# Altium project KMSwitch.PrjPcb
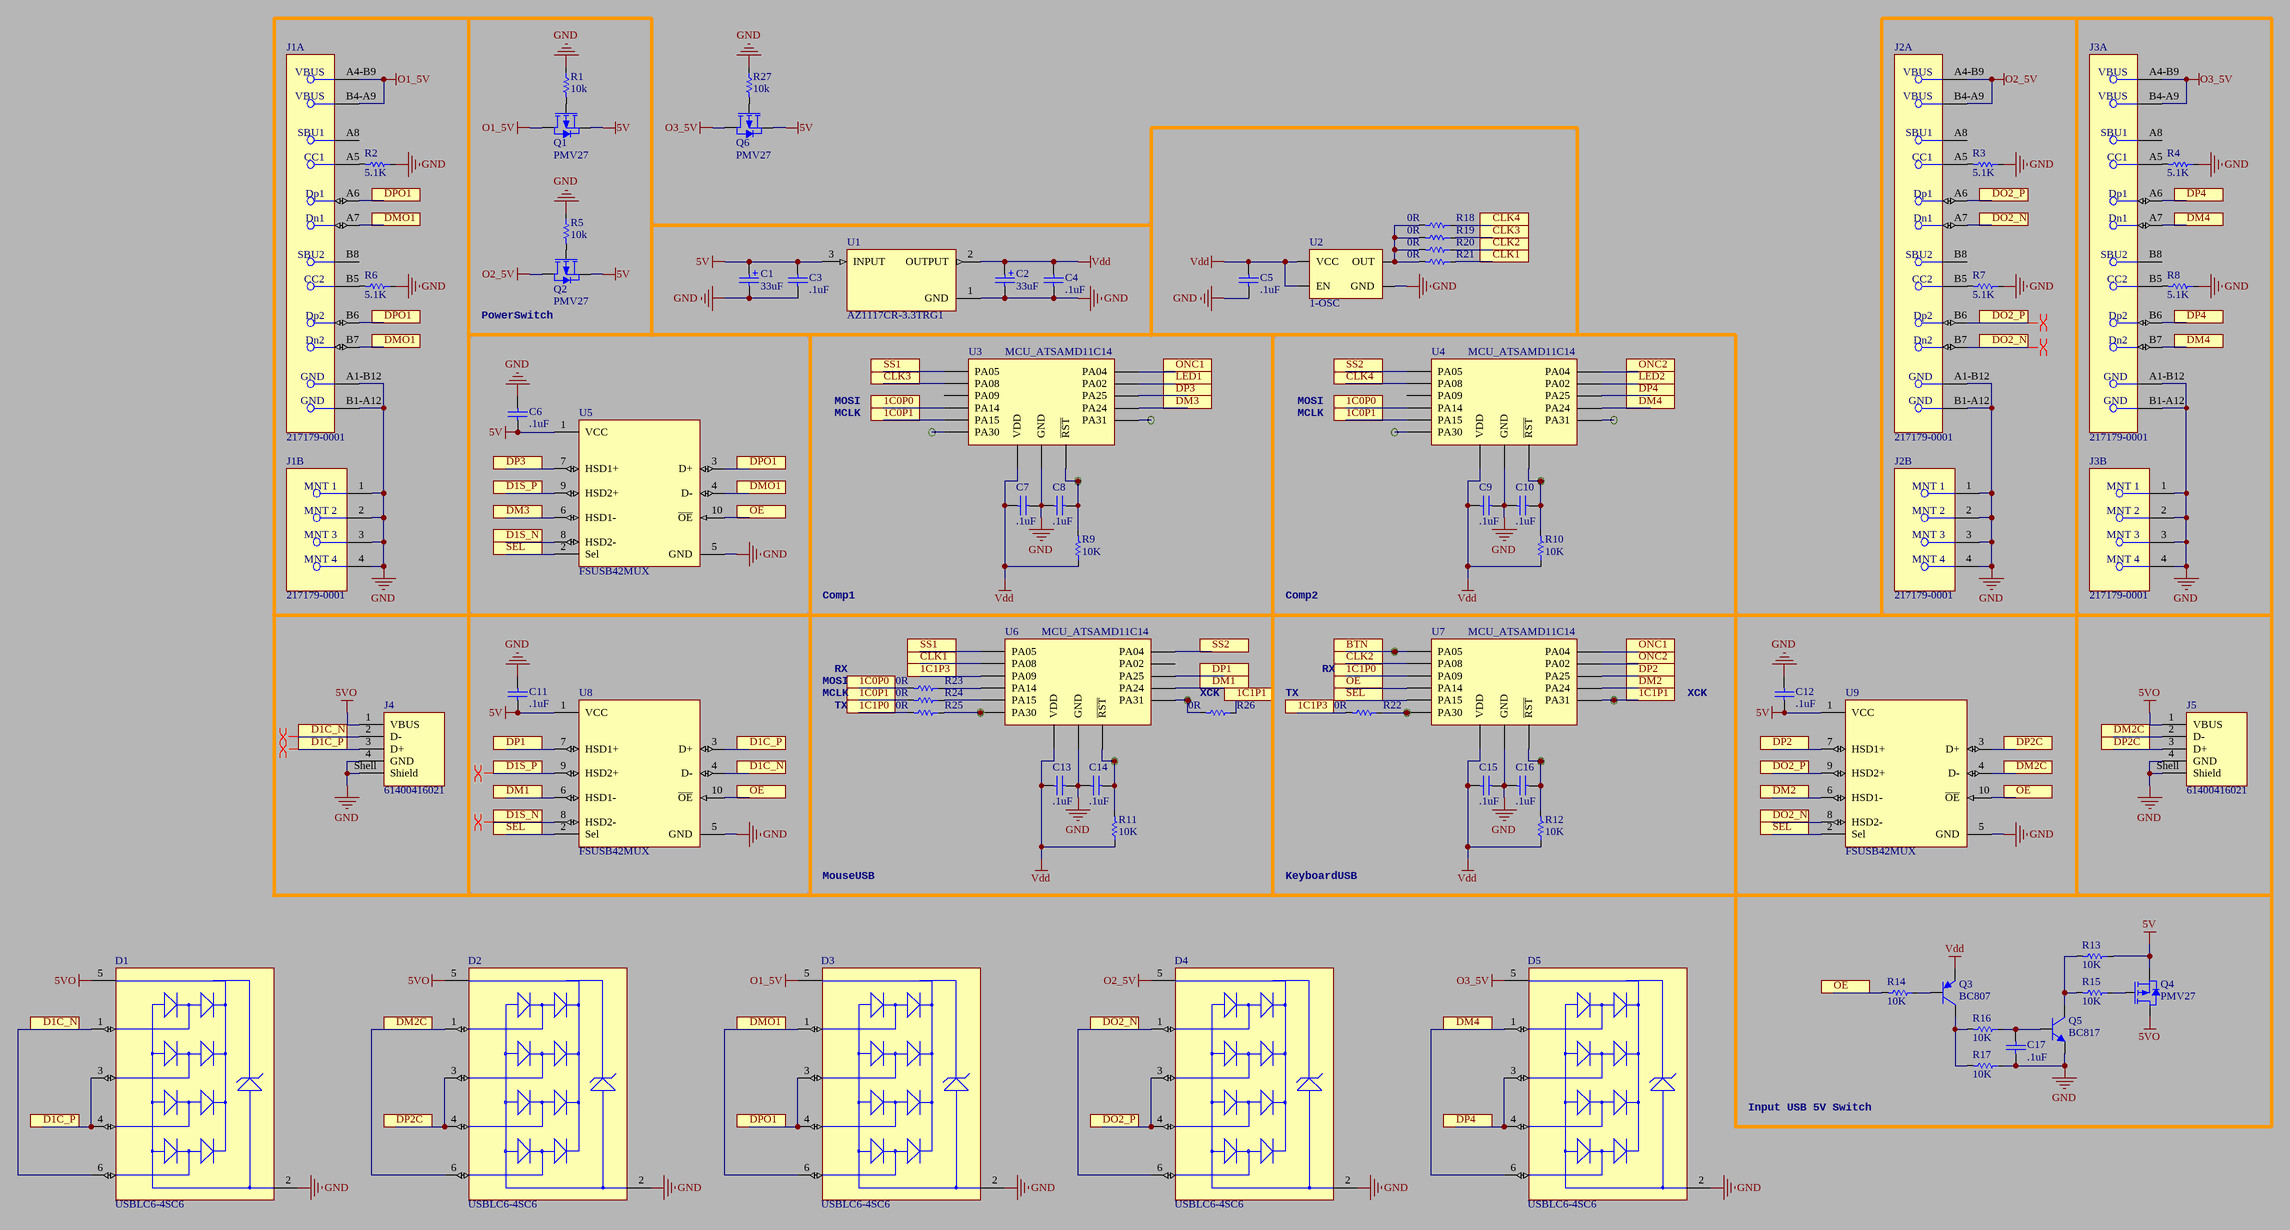
[diagram p0: Sheet1.SchDoc]
1 sheet, 82 parts. Net scope: global (net labels, ports and power ports of the same name join across sheets).
Board file: PCB1.PcbDoc

## Sheet Sheet1.SchDoc
size A2

### Parts
C1  value 33uF  [TH CAP AL-6.3X11MM-A1K2]  (hidden comment: Cap Non-Pol)
C2  value 33uF  [TH CAP AL-6.3X11MM-A1K2]  (hidden comment: Cap Non-Pol)
C3  value .1uF  [Size_0603_N]
C4  value .1uF  [Size_0603_N]
C5  value .1uF  [Size_0603_N]
C6  value .1uF  [Size_0603_N]
C7  value .1uF  [Size_0603_N]
C8  value .1uF  [Size_0603_N]
C9  value .1uF  [Size_0603_N]
C10  value .1uF  [Size_0603_N]
C11  value .1uF  [Size_0603_N]
C12  value .1uF  [Size_0603_N]
C13  value .1uF  [Size_0603_N]
C14  value .1uF  [Size_0603_N]
C15  value .1uF  [Size_0603_N]
C16  value .1uF  [Size_0603_N]
C17  value .1uF  [Size_0603_N]
D1  USBLC6-4SC6  [FP-SOT23-6L-MFG]
D2  USBLC6-4SC6  [FP-SOT23-6L-MFG]
D3  USBLC6-4SC6  [FP-SOT23-6L-MFG]
D4  USBLC6-4SC6  [FP-SOT23-6L-MFG]
D5  USBLC6-4SC6  [FP-SOT23-6L-MFG]
J1  217179-0001  [FP-2171790001-MFG]  (parts A,B of 2)
J2  217179-0001  [FP-2171790001-MFG]  (parts A,B of 2)
J3  217179-0001  [FP-2171790001-MFG]  (parts A,B of 2)
J4  61400416021  [61400416021]
J5  61400416021  [61400416021]
JP1  Pogo_Contact  [Pogo_254]  (value not drawn)
JP2  Pogo_Contact  [Pogo_254]  (value not drawn)
JP3  Pogo_Contact  [Pogo_254]  (value not drawn)
JP4  Pogo_Contact  [Pogo_254]  (value not drawn)
JP5  Pogo_Contact  [Pogo_254]  (value not drawn)
JP6  Pogo_Contact  [Pogo_254]  (value not drawn)
JP7  Pogo_Contact  [Pogo_254]  (value not drawn)
JP8  Pogo_Contact  [Pogo_254]  (value not drawn)
JP9  Pogo_Contact  [Pogo_254]  (value not drawn)
JP10  Pogo_Contact  [Pogo_254]  (value not drawn)
JP11  Pogo_Contact  [Pogo_254]  (value not drawn)
JP12  Pogo_Contact  [Pogo_254]  (value not drawn)
JP13  Pogo_Contact  [Pogo_254]  (value not drawn)
Q1  PMV27  [SOT23-3]
Q2  PMV27  [SOT23-3]
Q3  BC807  [SOT23-3]
Q4  PMV27  [SOT23-3]
Q5  BC817  [SOT23-3]
Q6  PMV27  [SOT23-3]
R1  value 10k  [Size_0603_N]  (hidden comment: 10k, *)
R2  value 5.1K  [Size_0603_N]  (hidden comment: 5.1K, *)
R3  value 5.1K  [Size_0603_N]  (hidden comment: 5.1K, *)
R4  value 5.1K  [Size_0603_N]  (hidden comment: 5.1K, *)
R5  value 10k  [Size_0603_N]  (hidden comment: 10k, *)
R6  value 5.1K  [Size_0603_N]  (hidden comment: 5.1K, *)
R7  value 5.1K  [Size_0603_N]  (hidden comment: 5.1K, *)
R8  value 5.1K  [Size_0603_N]  (hidden comment: 5.1K, *)
R9  value 10K  [Size_0603_N]  (hidden comment: 10K, *)
R10  value 10K  [Size_0603_N]  (hidden comment: 10K, *)
R11  value 10K  [Size_0603_N]  (hidden comment: 10K, *)
R12  value 10K  [Size_0603_N]  (hidden comment: 10K, *)
R13  value 10K  [Size_0603_N]  (hidden comment: 10K, *)
R14  value 10K  [Size_0603_N]  (hidden comment: 10K, *)
R15  value 10K  [Size_0603_N]  (hidden comment: 10K, *)
R16  value 10K  [Size_0603_N]  (hidden comment: 10K, *)
R17  value 10K  [Size_0603_N]  (hidden comment: 10K, *)
R18  value 0R  [Size_0603_N]  (hidden comment: 0R, *)
R19  value 0R  [Size_0603_N]  (hidden comment: 0R, *)
R20  value 0R  [Size_0603_N]  (hidden comment: 0R, *)
R21  value 0R  [Size_0603_N]  (hidden comment: 0R, *)
R22  value 0R  [Size_0603_N]  (hidden comment: 0R, *)
R23  value 0R  [Size_0603_N]  (hidden comment: 0R, *)
R24  value 0R  [Size_0603_N]  (hidden comment: 0R, *)
R25  value 0R  [Size_0603_N]  (hidden comment: 0R, *)
R26  value 0R  [Size_0603_N]  (hidden comment: 0R, *)
R27  value 10k  [Size_0603_N]  (hidden comment: 10k, *)
U1  AZ1117CR-3.3TRG1  [FP-SOT89-MFG]
U2  1-OSC  [2520osc]
U3  MCU_ATSAMD11C14  [SOIC127P600X175-14N]
U4  MCU_ATSAMD11C14  [SOIC127P600X175-14N]
U5  FSUSB42MUX  [FP-846AP-MFG]
U6  MCU_ATSAMD11C14  [SOIC127P600X175-14N]
U7  MCU_ATSAMD11C14  [SOIC127P600X175-14N]
U8  FSUSB42MUX  [FP-846AP-MFG]
U9  FSUSB42MUX  [FP-846AP-MFG]

### Blocks framed on the sheet
PowerSwitch: Q1 Q2 R1 R5
Input USB 5V Switch: C17 Q3-Q5 R13-R17

### Nets
5V: C1.1 C3.2 C6.1 C11.1 C12.1 Q1.3(S) Q2.3(S) Q4.3(S) Q6.3(S) R13.1 U1.3(INPUT) U5.1(VCC) U8.1(VCC) U9.1(VCC)
5VO: D1.5(VBUS) D2.5(VBUS) J4.1(VBUS) J5.1(VBUS) Q4.2(D)
GND: C1.2 C2.2 C3.1 C4.1 C5.1 C6.2 C7.2 C8.1 C9.2 C10.1 C11.2 C12.2 C13.2 C14.1 C15.2 C16.1 C17.1 D1.2(GND) D2.2(GND) D3.2(GND) D4.2(GND) D5.2(GND) J1.1(MNT_1) J1.2(MNT_2) J1.3(MNT_3) J1.4(MNT_4) J1.A1-B12(GND) J1.B1-A12(GND) J2.1(MNT_1) J2.2(MNT_2) J2.3(MNT_3) J2.4(MNT_4) J2.A1-B12(GND) J2.B1-A12(GND) J3.1(MNT_1) J3.2(MNT_2) J3.3(MNT_3) J3.4(MNT_4) J3.A1-B12(GND) J3.B1-A12(GND) J4.4(GND) J4.Shell(Shield) J5.4(GND) J5.Shell(Shield) Q5.2(E) R1.1 R2.1 R3.1 R4.1 R5.1 R6.1 R7.1 R8.1 R17.1 R27.1 U1.1(GND) U2.2(GND) U3.11(GND) U4.11(GND) U5.5(GND) U6.11(GND) U7.11(GND) U8.5(GND) U9.5(GND)
O1_5V: D3.5(VBUS) J1.A4-B9(VBUS) J1.B4-A9(VBUS) Q1.2(D)
O2_5V: D4.5(VBUS) J2.A4-B9(VBUS) J2.B4-A9(VBUS) Q2.2(D)
O3_5V: D5.5(VBUS) J3.A4-B9(VBUS) J3.B4-A9(VBUS) Q6.2(D)
Vdd: C2.1 C4.2 C5.2 C7.1 C9.1 C13.1 C15.1 Q3.2(E) R9.1 R10.1 R11.1 R12.1 U1.2(OUTPUT) U2.1(EN) U2.4(VCC) U3.12(VDD) U4.12(VDD) U6.12(VDD) U7.12(VDD)
1C0P0: R23.2 U3.4(PA14) U4.4(PA14)
1C0P1: R24.2 U3.5(PA15) U4.5(PA15)
1C1P0: R25.2 U7.3(PA09)
1C1P1: JP9.1 R26.1 U7.8(PA31)
1C1P3: R22.2 U6.3(PA09)
BTN: JP7.1 U7.1(PA05)
CLK1: R21.1 U6.2(PA08)
CLK2: R20.1 U7.2(PA08)
CLK3: R19.1 U3.2(PA08)
CLK4: R18.1 U4.2(PA08)
D1C_N: D1.1(I/O1) D1.6(I/O4) J4.2(D-) U8.4(D-)
D1C_P: D1.3(I/O2) D1.4(I/O3) J4.3(D+) U8.3(D+)
D1S_N: U5.8(HSD2-) U8.8(HSD2-)
D1S_P: U5.9(HSD2+) U8.9(HSD2+)
DM1: U6.9(PA24) U8.6(HSD1-)
DM2: U7.9(PA24) U9.6(HSD1-)
DM2C: D2.1(I/O1) D2.6(I/O4) J5.2(D-) U9.4(D-)
DM3: U3.9(PA24) U5.6(HSD1-)
DM4: D5.1(I/O1) D5.6(I/O4) J3.A7(Dn1) J3.B7(Dn2) U4.9(PA24)
DMO1: D3.1(I/O1) D3.6(I/O4) J1.A7(Dn1) J1.B7(Dn2) U5.4(D-)
DO2_N: D4.1(I/O1) D4.6(I/O4) J2.A7(Dn1) J2.B7(Dn2) U9.8(HSD2-)
DO2_P: D4.3(I/O2) D4.4(I/O3) J2.A6(Dp1) J2.B6(Dp2) U9.9(HSD2+)
DP1: U6.10(PA25) U8.7(HSD1+)
DP2: U7.10(PA25) U9.7(HSD1+)
DP2C: D2.3(I/O2) D2.4(I/O3) J5.3(D+) U9.3(D+)
DP3: U3.10(PA25) U5.7(HSD1+)
DP4: D5.3(I/O2) D5.4(I/O3) J3.A6(Dp1) J3.B6(Dp2) U4.10(PA25)
DPO1: D3.3(I/O2) D3.4(I/O3) J1.A6(Dp1) J1.B6(Dp2) U5.3(D+)
LED1: U3.13(PA02)
LED2: U4.13(PA02)
OE: R14.2 U5.10(~{OE}) U7.4(PA14) U8.10(~{OE}) U9.10(~{OE})
ONC1: U3.14(PA04) U7.14(PA04)
ONC2: U4.14(PA04) U7.13(PA02)
SEL: U5.2(Sel) U7.5(PA15) U8.2(Sel) U9.2(Sel)
SS1: U3.1(PA05) U6.1(PA05)
SS2: U4.1(PA05) U6.14(PA04)
NetC8_2: C8.2 JP5.1 R9.2 U3.6(~{RST})
NetC10_2: C10.2 JP6.1 R10.2 U4.6(~{RST})
NetC14_2: C14.2 JP12.1 R11.2 U6.6(~{RST})
NetC16_2: C16.2 JP13.1 R12.2 U7.6(~{RST})
NetC17_2: C17.2 Q5.1(B) R16.1
NetJ1_A5: J1.A5(CC1) R2.2
NetJ1_B5: J1.B5(CC2) R6.2
NetJ2_A5: J2.A5(CC1) R3.2
NetJ2_B5: J2.B5(CC2) R7.2
NetJ3_A5: J3.A5(CC1) R4.2
NetJ3_B5: J3.B5(CC2) R8.2
NetJP1_1: JP1.1 U3.8(PA31)
NetJP2_1: JP2.1 U4.8(PA31)
NetJP3_1: JP3.1 U3.7(PA30)
NetJP4_1: JP4.1 U4.7(PA30)
NetJP8_1: JP8.1 R26.2 U6.8(PA31)
NetJP10_1: JP10.1 R25.1 U6.7(PA30)
NetJP11_1: JP11.1 R22.1 U7.7(PA30)
NetQ1_1: Q1.1(G) R1.2
NetQ2_1: Q2.1(G) R5.2
NetQ3_1: Q3.1(B) R14.1
NetQ3_3: Q3.3(C) R16.2 R17.2
NetQ4_1: Q4.1(G) R15.1
NetQ5_3: Q5.3(C) R13.2 R15.2
NetQ6_1: Q6.1(G) R27.2
NetR18_2: R18.2 R19.2 R20.2 R21.2 U2.3(OUT)
NetR23_1: R23.1 U6.4(PA14)
NetR24_1: R24.1 U6.5(PA15)

Not connected (* = marked no-connect by the designer): J1 A8(SBU1) B8(SBU2); J2 A8(SBU1) B8(SBU2); J3 A8(SBU1) B8(SBU2); U3 3(PA09); U4 3(PA09); U6 13(PA02)

### Layout directives
differential pair: D1C_N, D1C_P, D1S_N, D1S_P, DO2_N, DO2_P

### Notes on the sheet
- MOSI
- MCLK
- Comp1
- Comp2
- RX
- XCK
- TX
- MouseUSB
- KeyboardUSB
- Revision:
- Title:

### Library data of the parts
C1 C2 = -Cap Pol: CAP, CER; Voltage: *
C3-C17 = -Cap Non-Pol: =Value; Voltage: *; Dielectric: *; Tol: *
D1-D5 = CMP-2000-07370-2: TVS DIODE 5.25V 17V SOT23-6; Manufacturer: STMicroelectronics; Peak Pulse Power: 130W; Breakdown Voltage: 6V; Value: 3pF; Direction: Unidirectional; Interface: USB,Ethernet,Other; Number Of Channels: 4; Standoff Height: 0mm; Max Junction Temp: +125°C; Description: 17V Clamp 5A (8/20µs) Ipp Tvs Diode Surface Mount SOT-23-6; Digikey Description: TVS DIODE 5.25V 17V SOT23-6; Automotive: No; Package: SOT23-6L; Mouser Description: USBLC6 Series 4 Line 6 V Uni / Bi-Directional ESD Protection - SOT-23-6; Octopart: https://octopart.com/usblc6-4sc6-stmicroelectronics-347147; RoHS: TRUE; ComponentLink2URL: https://upverter.com/datasheet/23dc4ffb028d868909e80577610284b194f13213.pdf; ComponentLink2Description: Datasheet; Device Class L1: Circuit Protection; Lead Free: Yes; Temperature Range High: +125°C; Device Class L2: ESD and Circuit Protection ICs; Device Class L3: unset; Capacitance: 3pF; Height: 1.45mm; Temperature Range Low: -40°C; Manufacturer Part Number: USBLC6-4SC6; Temperature: -40°C to +125°C; Category: Diode; Clamping Voltage: 17V
J1-J3 = CMP-04767-000028-2: CONN RCP USB2.0 TYP C 24P SMD RA; NexarPartId: 117190526; Gender: Receptacle; Number of Contacts: 16; Current Rating: 1.25A; Voltage Rating: 30V; Min Operating Temperature: -40°C; USB Standard: USB 2.0; Height: 3.36mm; Contact Material: Gold, Nickel; Max Operating Temperature: 85°C
J4 J5 = CMP-1502-03227-2: NexarPartId: 21041530; Contact Resistance: 20mΩ; Gender: Receptacle; Voltage Rating (DC): 30V; Current Rating: 1.5A; Connector Type: USB; Insulation Resistance: 1GΩ; USB Standard: USB 2.0; Number of Contacts: 4; Number of Ports: 1; Width: 14.4mm; REACH SVHC: Unknown; Contact Plating: Gold; Length: 15.8mm; Lead Free: Lead Free; Max Operating Temperature: 105°C; Orientation: Horizontal; Contact Material: Copper; Voltage Rating: 30V; Min Operating Temperature: -40°C; Flammability Rating: UL94 V-0; Color: White; RoHS: Compliant; Number of Pins: 4; Mount: Horizontal, Through Hole; Number of Positions: 4; Operating Supply Voltage: 30V; Insulation Material: PBT; Termination: Solder
Q1 Q2 Q4 Q6 = 1-Mosfet_P: P-Channel Enhancement Mosfet; pin to pad: 2>3 3>2
Q3 = 1-BJT-PNP
Q5 = 1-BJT_NPN: NPN General Purpose
R1-R27 = -Res: =Value; Tolerance: 1%; Power: *
U1 = CMP-12756-000007-1: IC REG LINEAR 3.3V 800MA SOT89; Manufacturer: Diodes Inc.; Nominal Supply Current: 4mA; Output Type: Fixed; Accuracy Percentage: 1%; Max Junction Temp: +125°C; Max Supply Voltage: 15V; Number Of Outputs: 1; Output Current: 1.35A; Dropout Voltage: 1.2V; Device Class L1: Integrated Circuits (ICs); ComponentLink2URL: https://www.diodes.com/assets/Datasheets/AZ1117C.pdf; Temperature Range High: +125°C; Octopart: https://octopart.com/az1117cr-3.3trg1-diodes+inc.-30954805; Output Voltage: 3.3V; Automotive: No; RoHS: TRUE; Temperature Range Low: -20°C; Package: SOT89; Height: 1.6mm; Mouser Description: DiodesZetex AZ1117CR-3.3TRG1, LDO Regulator, 800mA, 3.3 V, ±1% 3-Pin, SOT-89; Manufacturer Part Number: AZ1117CR-3.3TRG1; ComponentLink2Description: Datasheet; Device Class L2: Power Management ICs; Lead Free: Yes; Device Class L3: Voltage Regulators - Linear; Category: IC; Temperature: -20°C to +125°C; Footprint Url: https://www.diodes.com/assets/Package-Files/SOT89.pdf; Digikey Description: IC REG LINEAR 3.3V 800MA SOT89
U5 U8 U9 = CMP-07103-000004-1: IC USB SWITCH DPDT 10MSOP; Voltage: 4.3V; Current: 100mA; Number of Inputs: 2; Supply Type: Single; Number of Outputs: 4; Data Rate: 480Mbps; On-State Resistance: 6.5R; Min Supply Voltage: 3V; Package Quantity: 1; Length: 3mm; Radiation Hardening: No; Number of Pins: 10; Width: 3mm; Number of Channels: 2; REACH SVHC: No SVHC; Lead Free: Lead Free; Max Operating Temperature: 85°C; Min Operating Temperature: -40°C; Packaging: Tape and Reel; Throw Configuration: DPDT; Operating Supply Voltage: 4.3V; Max Supply Voltage: 4.3V; Mount: Surface Mount; Case/Package: MSOP; Weight: 0.1125g; Height: 0.85mm